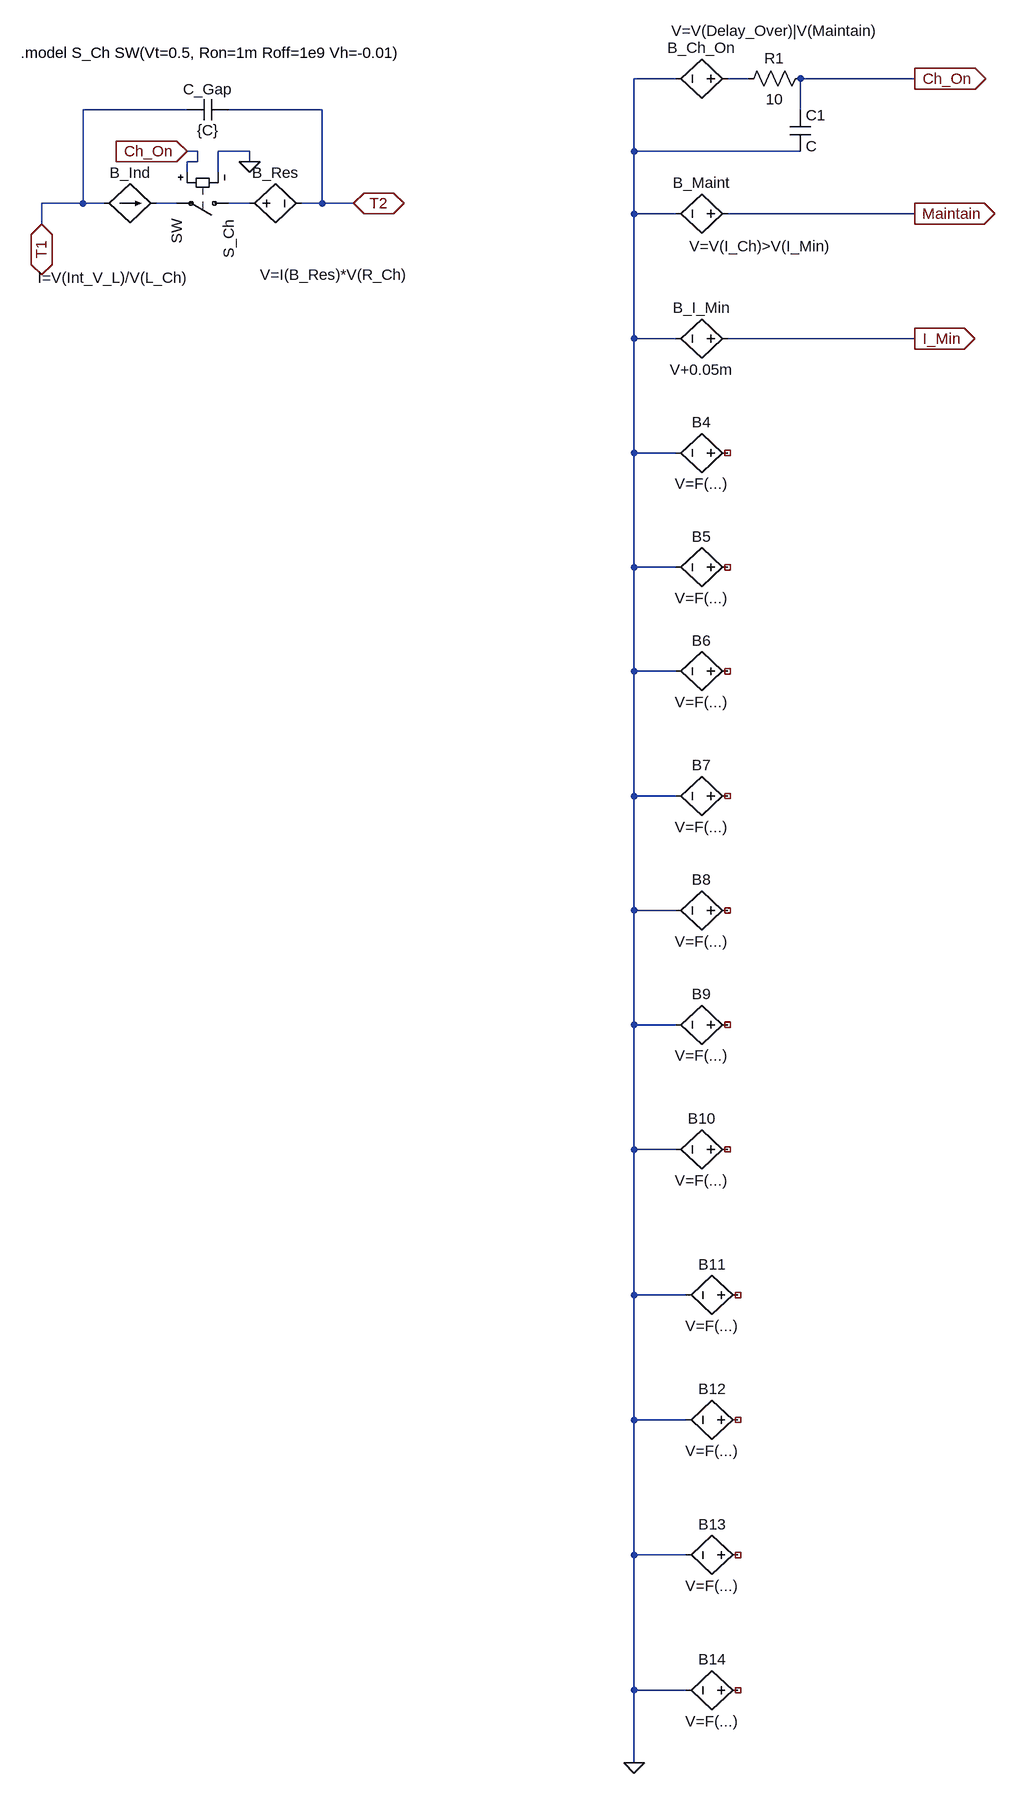
[diagram p0: schematic Draft3.asc]
Draft3.asc, the LTspice schematic file:
Version 4
SHEET 1 880 2164
WIRE 112 -464 48 -464
WIRE 224 -464 192 -464
WIRE 480 -464 304 -464
WIRE -640 -416 -800 -416
WIRE -432 -416 -576 -416
WIRE 304 -416 304 -464
WIRE -624 -352 -640 -352
WIRE -544 -352 -592 -352
WIRE 48 -352 48 -464
WIRE 304 -352 48 -352
WIRE -624 -336 -624 -352
WIRE -624 -336 -640 -336
WIRE -544 -336 -544 -352
WIRE -640 -320 -640 -336
WIRE -592 -320 -592 -352
WIRE -800 -272 -800 -416
WIRE -800 -272 -864 -272
WIRE -768 -272 -800 -272
WIRE -656 -272 -688 -272
WIRE -544 -272 -576 -272
WIRE -432 -272 -432 -416
WIRE -432 -272 -464 -272
WIRE -384 -272 -432 -272
WIRE 48 -256 48 -352
WIRE 112 -256 48 -256
WIRE 480 -256 192 -256
WIRE -864 -240 -864 -272
WIRE 48 -64 48 -256
WIRE 112 -64 48 -64
WIRE 480 -64 192 -64
WIRE 48 112 48 -64
WIRE 112 112 48 112
WIRE 48 288 48 112
WIRE 112 288 48 288
WIRE 48 448 48 288
WIRE 112 448 48 448
WIRE 48 640 48 448
WIRE 112 640 48 640
WIRE 48 816 48 640
WIRE 112 816 48 816
WIRE 48 992 48 816
WIRE 112 992 48 992
WIRE 48 1184 48 992
WIRE 112 1184 48 1184
WIRE 48 1408 48 1184
WIRE 128 1408 48 1408
WIRE 48 1600 48 1408
WIRE 128 1600 48 1600
WIRE 48 1808 48 1600
WIRE 128 1808 48 1808
WIRE 48 2016 48 1808
WIRE 128 2016 48 2016
WIRE 48 2128 48 2016
FLAG -640 -352 Ch_On
IOPIN -640 -352 In
FLAG -544 -336 0
FLAG -864 -240 T1
IOPIN -864 -240 BiDir
FLAG -384 -272 T2
IOPIN -384 -272 BiDir
FLAG 48 2128 0
FLAG 480 -464 Ch_On
IOPIN 480 -464 Out
FLAG 480 -256 Maintain
IOPIN 480 -256 Out
FLAG 480 -64 I_Min
IOPIN 480 -64 Out
SYMBOL sw -560 -272 R90
SYMATTR InstName S_Ch
SYMBOL bv -560 -272 R270
WINDOW 0 32 56 VTop 2
WINDOW 3 -94 146 VBottom 2
SYMATTR InstName B_Res
SYMATTR Value V=I(B_Res)*V(R_Ch)
SYMBOL bi -768 -272 R270
WINDOW 0 32 40 VTop 2
WINDOW 3 -99 15 VBottom 2
SYMATTR InstName B_Ind
SYMATTR Value I=V(Int_V_L)/V(L_Ch)
SYMBOL cap -576 -432 R90
WINDOW 0 0 32 VBottom 2
WINDOW 3 32 32 VTop 2
SYMATTR InstName C_Gap
SYMATTR Value {C}
SYMBOL bv 208 -464 R90
WINDOW 0 -32 56 VBottom 2
WINDOW 3 -89 -57 VTop 2
SYMATTR InstName B_Ch_On
SYMATTR Value V=V(Delay_Over)|V(Maintain)
SYMBOL bv 208 -256 R90
WINDOW 0 -32 56 VBottom 2
WINDOW 3 34 -35 VTop 2
SYMATTR InstName B_Maint
SYMATTR Value V=V(I_Ch)>V(I_Min)
SYMBOL bv 208 -64 R90
WINDOW 0 -32 56 VBottom 2
WINDOW 3 32 56 VTop 2
SYMATTR InstName B_I_Min
SYMATTR Value V+0.05m
SYMBOL bv 208 112 R90
WINDOW 0 -32 56 VBottom 2
WINDOW 3 32 56 VTop 2
SYMATTR InstName B4
SYMBOL bv 208 288 R90
WINDOW 0 -32 56 VBottom 2
WINDOW 3 32 56 VTop 2
SYMATTR InstName B5
SYMBOL bv 208 448 R90
WINDOW 0 -32 56 VBottom 2
WINDOW 3 32 56 VTop 2
SYMATTR InstName B6
SYMBOL bv 208 640 R90
WINDOW 0 -32 56 VBottom 2
WINDOW 3 32 56 VTop 2
SYMATTR InstName B7
SYMBOL bv 208 816 R90
WINDOW 0 -32 56 VBottom 2
WINDOW 3 32 56 VTop 2
SYMATTR InstName B8
SYMBOL bv 208 992 R90
WINDOW 0 -32 56 VBottom 2
WINDOW 3 32 56 VTop 2
SYMATTR InstName B9
SYMBOL bv 208 1184 R90
WINDOW 0 -32 56 VBottom 2
WINDOW 3 32 56 VTop 2
SYMATTR InstName B10
SYMBOL bv 224 1408 R90
WINDOW 0 -32 56 VBottom 2
WINDOW 3 32 56 VTop 2
SYMATTR InstName B11
SYMBOL bv 224 1600 R90
WINDOW 0 -32 56 VBottom 2
WINDOW 3 32 56 VTop 2
SYMATTR InstName B12
SYMBOL bv 224 1808 R90
WINDOW 0 -32 56 VBottom 2
WINDOW 3 32 56 VTop 2
SYMATTR InstName B13
SYMBOL bv 224 2016 R90
WINDOW 0 -32 56 VBottom 2
WINDOW 3 32 56 VTop 2
SYMATTR InstName B14
SYMBOL cap 288 -416 R0
SYMATTR InstName C1
SYMBOL res 320 -480 R90
WINDOW 0 0 56 VBottom 2
WINDOW 3 32 56 VTop 2
SYMATTR InstName R1
SYMATTR Value 10
TEXT -896 -504 Left 2 !.model S_Ch SW(Vt=0.5, Ron=1m Roff=1e9 Vh=-0.01)

The netlist it stands for:
* Draft3.asc
S_Ch N003 N002 Ch_On 0 SW
B_Res N003 T2 V=I(B_Res)*V(R_Ch)
B_Ind T1 N002 I=V(Int_V_L)/V(L_Ch)
C_Gap T2 T1 {C}
B_Ch_On N001 0 V=V(Delay_Over)|V(Maintain)
B_Maint Maintain 0 V=V(I_Ch)>V(I_Min)
B_I_Min I_Min 0 V+0.05m
B4 NC_01 0 V=F(...)
B5 NC_02 0 V=F(...)
B6 NC_03 0 V=F(...)
B7 NC_04 0 V=F(...)
B8 NC_05 0 V=F(...)
B9 NC_06 0 V=F(...)
B10 NC_07 0 V=F(...)
B11 NC_08 0 V=F(...)
B12 NC_09 0 V=F(...)
B13 NC_10 0 V=F(...)
B14 NC_11 0 V=F(...)
C1 Ch_On 0 C
R1 Ch_On N001 10
.model S_Ch SW(Vt=0.5, Ron=1m Roff=1e9 Vh=-0.01)
.backanno
.end